# EAGLE schematic ArduinoMicroFullCustom (EAGLE 6.5.0)
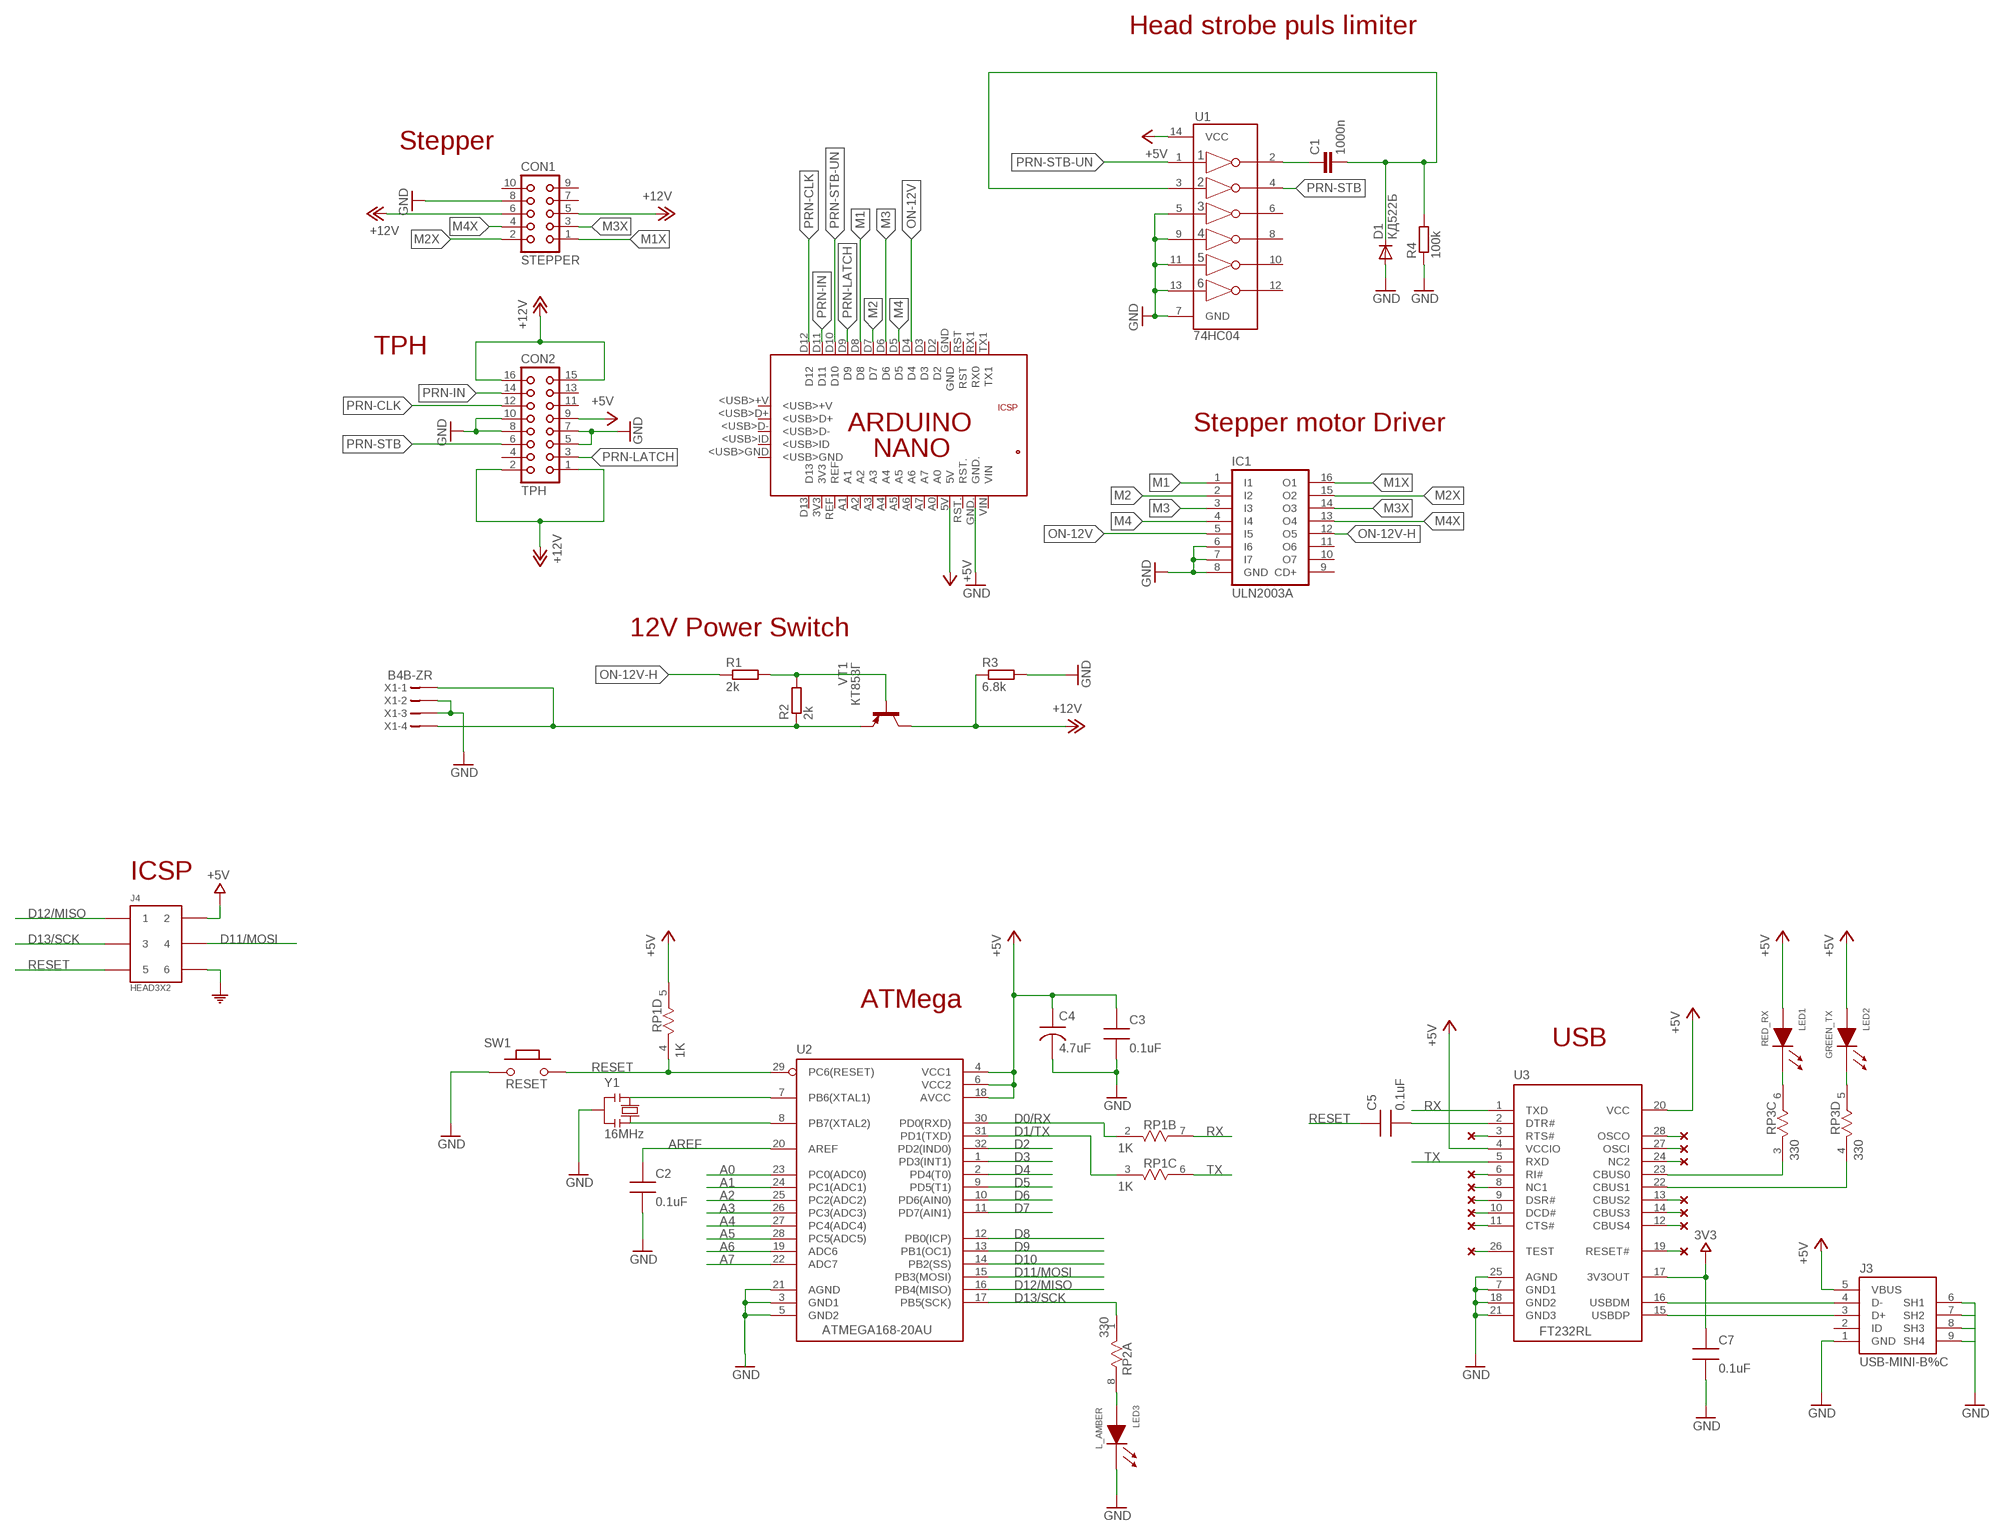
[diagram p0: schematic, sheet 1]

## Parts
C1  1000n  C-EU075-032X103  [C075-032X103]
C2  0.1uF  CAP0805-NP  [CAP0805-NP]
C3  0.1uF  CAP0805-NP  [CAP0805-NP]
C4  4.7uF  CAP-TANA-P  [TAN-A]
C5  0.1uF  CAP0805-NP  [CAP0805-NP]
C7  0.1uF  CAP0805-NP  [CAP0805-NP]
CON1  STEPPER  CON10  [CON10]
CON2  TPH  CON16  [CON16]
D1  КД522Б  1N4148DO35-10  [DO35-10]
IC1  ULN2003A  ULN2003AN  [DIL16]
J3  USB-MINI-B%C  [USB-MINI-B_2]
J4  HEAD3X2  [HEAD3X2]
LED1  RED_RX  LED0805  [LED0805]
LED2  GREEN_TX  LED0805  [LED0805]
LED3  L_AMBER  LED0805  [LED0805]
PCB1  ARDUINO_NANO  [ARDUINO_NANO]
R1  2k  R-EU_0207/12  [0207/12]
R2  2k  R-EU_0207/12  [0207/12]
R3  6.8k  R-EU_0207/12  [0207/12]
R4  100k  R-EU_0309/12  [0309/12]
RP1  1K  RES4NT  [RES4NT]
RP2  330  RES4NT  [RES4NT]
RP3  330  RES4NT  [RES4NT]
SW1  RESET  PB157  [157SW]
U1  74HC04  74HC04_HEX_INVERTER  [DIL14]
U2  ATMEGA168-20AU  [QFP032]
U3  FT232RL  [SSOP28]
VT1  КТ853Г  TIP30  [TO220]
X1  B4B-ZR  [B4B-ZR]
Y1  16MHz  RESONATORMU  [RESONATOR]

## Nets
3V3: C7.1 U3.17(3V3OUT)
+5V: C3.1 C4.1 CON2.9 J3.5(VBUS) J4.2 LED1.2(AN) LED2.2(AN) PCB1.5V RP1.5 U1.14(VCC) U2.4(VCC1) U2.6(VCC2) U2.18(AVCC) U3.4(VCCIO) U3.20(VCC)
+12V: CON1.5 CON1.6 CON2.1 CON2.2 CON2.15 CON2.16 R3.1 VT1.2(C)
A0: U2.23(PC0(ADC0))
A1: U2.24(PC1(ADC1))
A2: U2.25(PC2(ADC2))
A3: U2.26(PC3(ADC3))
A4: U2.27(PC4(ADC4))
A5: U2.28(PC5(ADC5))
A6: U2.19(ADC6)
A7: U2.22(ADC7)
AREF: C2.1 U2.20(AREF)
COM: J4.6
D0/RX: RP1.2 U2.30(PD0(RXD))
D1/TX: RP1.3 U2.31(PD1(TXD))
D2: U2.32(PD2(IND0))
D3: U2.1(PD3(INT1))
D4: U2.2(PD4(T0))
D5: U2.9(PD5(T1))
D6: U2.10(PD6(AIN0))
D7: U2.11(PD7(AIN1))
D8: U2.12(PB0(ICP))
D9: U2.13(PB1(OC1))
D10: U2.14(PB2(SS))
D11/MOSI: J4.4 U2.15(PB3(MOSI))
D12/MISO: J4.1 U2.16(PB4(MISO))
D13/SCK: J4.3 RP2.1 U2.17(PB5(SCK))
GND: C2.2 C3.2 C4.2 C7.2 CON1.8 CON2.5 CON2.7 CON2.8 CON2.10 D1.A IC1.6(I6) IC1.7(I7) IC1.8(GND) J3.1(GND) J3.6(SH1) J3.7(SH2) J3.8(SH3) J3.9(SH4) LED3.1(CA) PCB1.GND. R3.2 R4.1 SW1.1 U1.5(3A) U1.7(GND) U1.9(4A) U1.11(5A) U1.13(6A) U2.3(GND1) U2.5(GND2) U2.21(AGND) U3.7(GND1) U3.18(GND2) U3.21(GND3) U3.25(AGND) X1.2 X1.3 Y1.2
M1: IC1.1(I1) PCB1.D8
M1X: CON1.1 IC1.16(O1)
M2: IC1.2(I2) PCB1.D7
M2X: CON1.2 IC1.15(O2)
M3: IC1.3(I3) PCB1.D6
M3X: CON1.3 IC1.14(O3)
M4: IC1.4(I4) PCB1.D5
M4X: CON1.4 IC1.13(O4)
N$1: C1.1 U1.2(1Y)
N$2: C1.2 D1.C R4.2 U1.3(2A)
N$3: R1.2 R2.2 VT1.1(B)
N$4: U2.7(PB6(XTAL1)) Y1.1
N$5: R2.1 VT1.3(E) X1.1 X1.4
N$6: U2.8(PB7(XTAL2)) Y1.3
N$7: LED3.2(AN) RP2.8
N$8: C5.2 U3.2(DTR#)
N$9: J3.3(D+) U3.15(USBDP)
N$10: J3.4(D-) U3.16(USBDM)
N$11: RP3.3 U3.23(CBUS0)
N$12: RP3.4 U3.22(CBUS1)
N$13: U3.11(CTS#)
N$14: U3.6(RI#)
N$15: U3.8(NC1)
N$16: U3.9(DSR#)
N$17: U3.10(DCD#)
N$18: U3.28(OSCO)
N$19: U3.27(OSCI)
N$20: U3.24(NC2)
N$21: U3.13(CBUS2)
N$22: U3.14(CBUS3)
N$23: U3.12(CBUS4)
N$24: U3.19(RESET#)
N$25: LED1.1(CA) RP3.6
N$26: U3.26(TEST)
N$27: U3.3(RTS#)
N$28: LED2.1(CA) RP3.5
ON-12V: IC1.5(I5) PCB1.D4
ON-12V-H: IC1.12(O5) R1.1
PRN-CLK: CON2.12 PCB1.D12
PRN-IN: CON2.14 PCB1.D11
PRN-LATCH: CON2.3 PCB1.D9
PRN-STB: CON2.6 U1.4(2Y)
PRN-STB-UN: PCB1.D10 U1.1(1A)
RESET: C5.1 J4.5 RP1.4 SW1.2 U2.29(PC6(RESET))
RX: RP1.7 U3.1(TXD)
TX: RP1.6 U3.5(RXD)
Unconnected: CON1.7 CON1.9 CON1.10 CON2.4 CON2.11 CON2.13 IC1.9(CD+) IC1.10(O7) IC1.11(O6) J3.2(ID) PCB1.3V3 PCB1.5V. PCB1.<USB>+V PCB1.<USB>D+ PCB1.<USB>D- PCB1.<USB>GND PCB1.<USB>ID PCB1.A0 PCB1.A1 PCB1.A2 PCB1.A3 PCB1.A4 PCB1.A5 PCB1.A6 PCB1.A7 PCB1.D2 PCB1.D3 PCB1.D13 PCB1.GND PCB1.GND_ PCB1.MISO PCB1.MOSI PCB1.REF PCB1.RESET.. PCB1.RST PCB1.RST. PCB1.RX1(RX0) PCB1.SCK PCB1.TX1 PCB1.VIN RP1.1 RP1.8 RP2.2 RP2.3 RP2.4 RP2.5 RP2.6 RP2.7 RP3.1 RP3.2 RP3.7 RP3.8 U1.6(3Y) U1.8(4Y) U1.10(5Y) U1.12(6Y)

## Notes on the sheet
- Head strobe puls limiter
- Stepper
- TPH
- Stepper motor Driver
- 12V Power Switch
- ICSP
- ATMega
- USB

## Library data of the parts
C1 = resistor:C-EU: CAPACITOR, European symbol
C2 C3 C5 C7 = MySMD:CAP0805-NP
C4 = MySMD:CAP-TANA-P
CON1 = con-harting:CON10: CONNECTOR; MF: TE CONNECTIVITY / AMP; MPN: 0-281273-1; OC_FARNELL: 3816278; OC_NEWARK: unknown
CON2 = con-harting:CON16: CONNECTOR; MF: TE CONNECTIVITY / AMP; MPN: 1-1634688-0; OC_FARNELL: 8395918; OC_NEWARK: unknown
D1 = diode:1N4148: DIODE high speed (Philips)
IC1 = uln-udn:ULN2003A: DRIVER ARRAY
J3 = MyCON2:USB-MINI-B
J4 = MyCON2:HEAD3X2
LED1-LED3 = MySMD:LED0805
PCB1 = E14_Arduino:ARDUINO_NANO: Device for representing an Arduino Nano board with a footprint in an EAGLE design. Created by Dave Young for Element14. More EAGLE documentation at: http://www.element14.com/community/community/knode/cadsoft_eagle; MF: ARDUINO; MPN: A000005; OC_FARNELL: 1848691
R1-R4 = resistor:R-EU_: RESISTOR, European symbol
RP1-RP3 = MySMD:RES4NT
SW1 = MySMD:PB157
U1 = 74hc04:74HC04_HEX_INVERTER: 74HC04 Hex Inverter
U2 = MySMD:ATMEGA168-20AU
U3 = MySMD2:FT232RL
VT1 = transistor-pnp:TIP30: PNP Transistor
X1 = con-jst:?4B-ZR: ZH CONNECTOR 1.5 mm, 4 pin 1 row Source: http://www.jst.com .. eZH.pdf; MF: FARNELL; MPN: B4B-ZR(LF)(SN); OC_FARNELL: 1830916; OC_NEWARK: 37K9960
Y1 = MySMD2:RESONATOR